# Altium schematic sheet NAPaC_DetachableModule.SchDoc
size A4
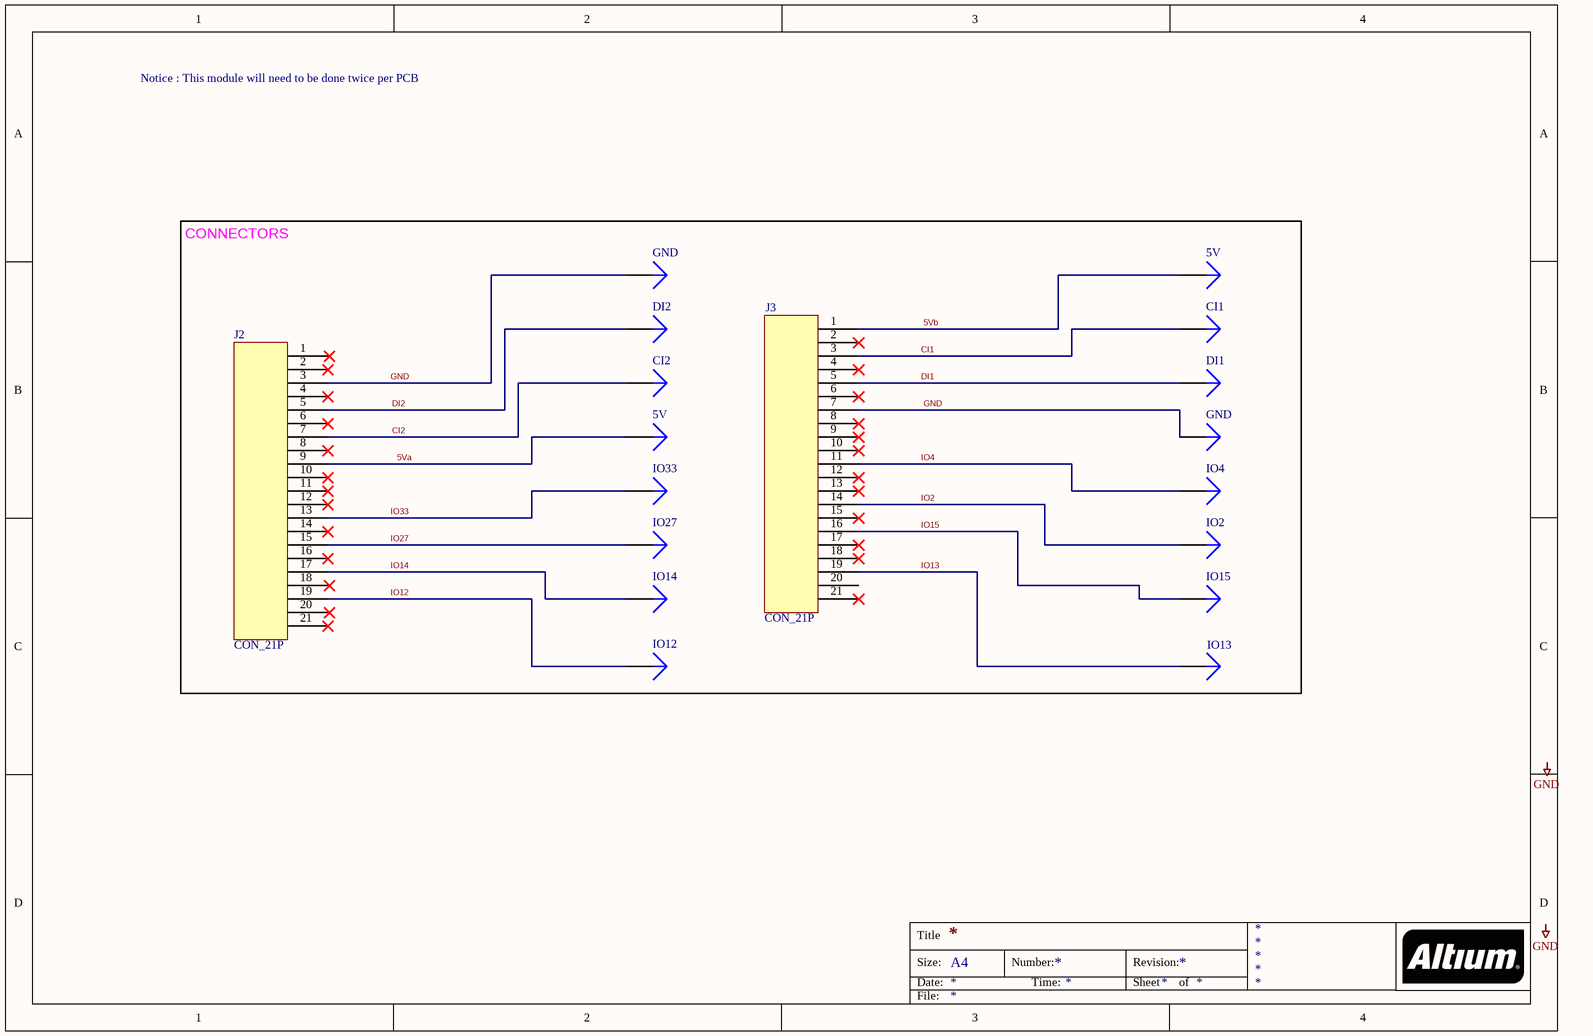
[diagram p0: NAPaC_DetachableModule.SchDoc]

## Parts
(Parts that share a designator on the sheet are numbered #1, #2 ... from top to bottom, then left to right.)
5V#1  Plug  [PIN_1]  (value not drawn)
5V#2  Plug  [PIN_1]  (value not drawn)
CI1  Plug  [PIN_1]  (value not drawn)
CI2  Plug  [PIN_1]  (value not drawn)
DI1  Plug  [PIN_1]  (value not drawn)
DI2  Plug  [PIN_1]  (value not drawn)
GND#1  Plug  [PIN_1]  (value not drawn)
GND#2  Plug  [PIN_1]  (value not drawn)
IO2  Plug  [PIN_1]  (value not drawn)
IO4  Plug  [PIN_1]  (value not drawn)
IO12  Plug  [PIN_1]  (value not drawn)
IO13  Plug  [PIN_1]  (value not drawn)
IO14  Plug  [PIN_1]  (value not drawn)
IO15  Plug  [PIN_1]  (value not drawn)
IO27  Plug  [PIN_1]  (value not drawn)
IO33  Plug  [PIN_1]  (value not drawn)
J2  CON_21P  [PINS_HEADER-21]
J3  CON_21P  [PINS_HEADER-21]

## Blocks framed on the sheet
CONNECTORS: 5V#1 5V#2 CI1 CI2 DI1 DI2 GND#1 GND#2 IO2 IO4 IO12-IO15 IO27 IO33 J2 J3

## Nets
GND: GND#1.1 GND#2.1 J2.3 J3.7
5Va: 5V#2.1 J2.9
5Vb: 5V#1.1 J3.1
CI1: CI1.1 J3.3
CI2: CI2.1 J2.7
DI1: DI1.1 J3.5
DI2: DI2.1 J2.5
IO2: IO2.1 J3.14
IO4: IO4.1 J3.11
IO12: IO12.1 J2.19
IO13: IO13.1 J3.19
IO14: IO14.1 J2.17
IO15: IO15.1 J3.16
IO27: IO27.1 J2.15
IO33: IO33.1 J2.13

Not connected (* = marked no-connect by the designer): J2 1 2(1)* 4(1)* 6(1)* 8(1)* 10(1)* 11(1)* 12(1)* 14(1)* 16(1)* 18(1) 20(1) 21(1)*; J3 2(1)* 4(1)* 6(1)* 8(1)* 9(1)* 10(1)* 12(1)* 13(1)* 15(1)* 17(1)* 18(1)* 20(1) 21(1)*

## Notes on the sheet
- Notice : This module will need to be done twice per PCB
- Labels drawn without touching a wire or pin: GND
- Title
- Size:
- Date:
- A4
- Number:
- Time:
- Revision:
- Sheet
- of
- File:

## Library data of the parts
J2 J3 = PINS_HEADER: 21 Positions Header, Breakaway Connector 0.100" (2.54mm) Through Hole Tin; Supplier 1: Digi-Key; Supplier Part Number 1: S1012EC-21-ND
5V#1 5V#2 CI1 CI2 DI1 DI2 GND#1 GND#2 IO2 IO4 IO12-IO15 IO27 IO33 = Plug: LatestRevisionDate: 17-Jul-2002; LatestRevisionNote: Re-released for DXP Platform.; Publisher: Altium Limited